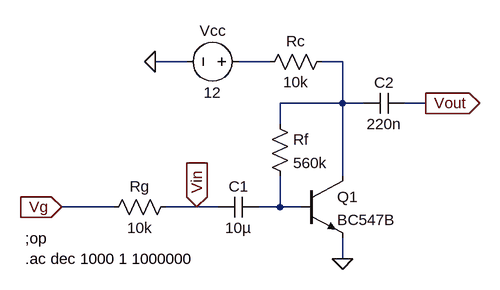
[diagram p0: schematic circuito-1.asc]
circuito-1.asc, the LTspice schematic file:
Version 4
SHEET 1 880 680
WIRE 176 -160 128 -160
WIRE 304 -160 256 -160
WIRE 416 -160 384 -160
WIRE 416 -96 416 -160
WIRE 416 -96 320 -96
WIRE 448 -96 416 -96
WIRE 544 -96 512 -96
WIRE 320 -64 320 -96
WIRE 416 16 416 -96
WIRE 64 64 -16 64
WIRE 192 64 144 64
WIRE 224 64 192 64
WIRE 320 64 320 16
WIRE 320 64 288 64
WIRE 352 64 320 64
WIRE 416 144 416 112
FLAG 128 -160 0
FLAG 544 -96 Vout
IOPIN 544 -96 Out
FLAG -16 64 Vg
IOPIN -16 64 In
FLAG 192 64 Vin
IOPIN 192 64 In
FLAG 416 144 0
SYMBOL cap 288 48 R90
WINDOW 0 0 32 VBottom 2
WINDOW 3 32 32 VTop 2
SYMATTR InstName C1
SYMATTR Value 10µ
SYMBOL res 160 48 R90
WINDOW 0 0 56 VBottom 2
WINDOW 3 32 56 VTop 2
SYMATTR InstName Rg
SYMATTR Value 10k
SYMBOL npn 352 16 R0
SYMATTR InstName Q1
SYMATTR Value BC547B
SYMBOL res 304 -80 R0
SYMATTR InstName Rf
SYMATTR Value 560k
SYMBOL res 400 -176 R90
WINDOW 0 0 56 VBottom 2
WINDOW 3 32 56 VTop 2
SYMATTR InstName Rc
SYMATTR Value 10k
SYMBOL voltage 272 -160 R90
WINDOW 0 -32 56 VBottom 2
WINDOW 3 32 56 VTop 2
SYMATTR InstName Vcc
SYMATTR Value 12
SYMBOL cap 512 -112 R90
WINDOW 0 0 32 VBottom 2
WINDOW 3 32 32 VTop 2
SYMATTR InstName C2
SYMATTR Value 220n
TEXT -72 144 Left 2 !.ac dec 1000 1 1000000
TEXT -72 112 Left 2 !;op

The netlist it stands for:
* circuito-1.asc
C1 N003 Vin 10µ
Rg Vin Vg 10k
Q1 N002 N003 0 0 BC547B
Rf N002 N003 560k
Rc N002 N001 10k
Vcc N001 0 12
C2 Vout N002 220n
.model NPN NPN
.model PNP PNP
.lib standard.bjt
.ac dec 1000 1 1000000
;op
.backanno
.end